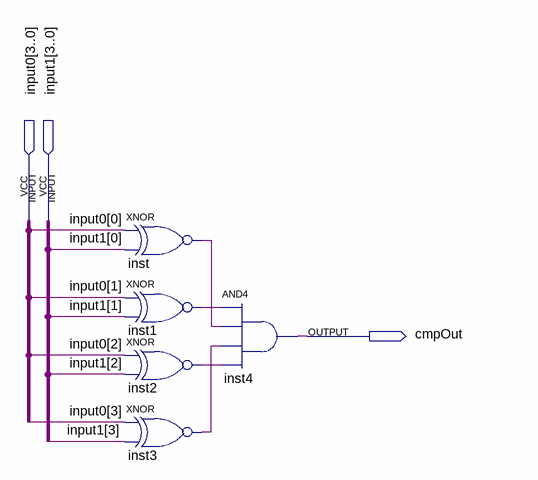
[diagram p0: schematic sheet]
// Quartus schematic EqCmp4.bdf as structural Verilog: 5 symbols, 3 pins
module EqCmp4 (
  input  [3:0] input0,
  input  [3:0] input1,
  output cmpOut
);

  wire inst1_out, inst2_out, inst3_out, inst_out;

  xnor inst (inst_out, input0[0], input1[0]);
  xnor inst1 (inst1_out, input0[1], input1[1]);
  xnor inst2 (inst2_out, input0[2], input1[2]);
  xnor inst3 (inst3_out, input0[3], input1[3]);
  and inst4 (cmpOut, inst1_out, inst_out, inst3_out, inst2_out);
endmodule
